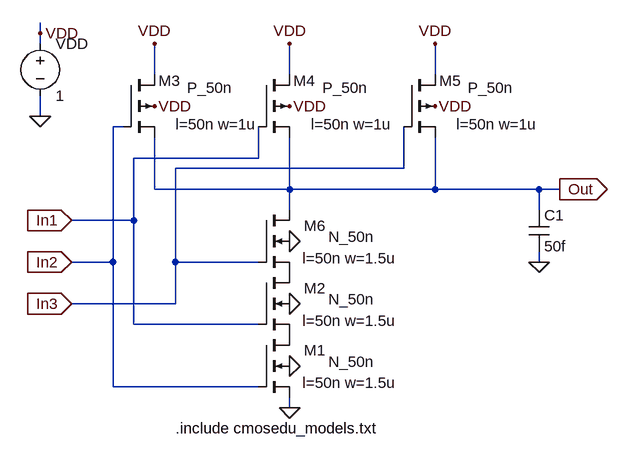
[diagram p0: schematic NAND3.asc]
NAND3.asc, the LTspice schematic file:
Version 4
SHEET 1 1208 680
WIRE 320 -512 320 -528
WIRE 320 -496 320 -512
WIRE 496 -448 496 -496
WIRE 704 -448 704 -496
WIRE 928 -448 928 -496
WIRE 320 -384 320 -416
WIRE 448 -368 432 -368
WIRE 656 -320 656 -368
WIRE 656 -320 464 -320
WIRE 880 -304 880 -368
WIRE 880 -304 528 -304
WIRE 496 -272 496 -352
WIRE 704 -272 704 -352
WIRE 704 -272 496 -272
WIRE 928 -272 928 -352
WIRE 928 -272 704 -272
WIRE 1088 -272 928 -272
WIRE 1120 -272 1088 -272
WIRE 704 -240 704 -272
WIRE 1088 -240 1088 -272
WIRE 464 -224 464 -320
WIRE 464 -224 368 -224
WIRE 432 -160 432 -368
WIRE 432 -160 368 -160
WIRE 528 -160 528 -304
WIRE 656 -160 528 -160
WIRE 1088 -160 1088 -176
WIRE 528 -96 528 -160
WIRE 528 -96 368 -96
WIRE 464 -64 464 -224
WIRE 656 -64 464 -64
WIRE 432 32 432 -160
WIRE 656 32 432 32
WIRE 704 64 704 48
FLAG 704 -96 0
FLAG 320 -384 0
FLAG 320 -512 VDD
FLAG 496 -400 VDD
FLAG 704 64 0
FLAG 496 -496 VDD
FLAG 704 -400 VDD
FLAG 704 -496 VDD
FLAG 704 0 0
FLAG 1088 -160 0
FLAG 1120 -272 Out
IOPIN 1120 -272 Out
FLAG 368 -224 In1
IOPIN 368 -224 In
FLAG 368 -160 In2
IOPIN 368 -160 In
FLAG 928 -400 VDD
FLAG 928 -496 VDD
FLAG 704 -192 0
FLAG 368 -96 In3
IOPIN 368 -96 In
SYMBOL voltage 320 -512 R0
WINDOW 123 0 0 Left 2
WINDOW 39 0 0 Left 2
SYMATTR InstName VDD
SYMATTR Value 1
SYMBOL pmos4 448 -448 R0
WINDOW 0 88 9 Right 2
WINDOW 3 168 20 Right 2
WINDOW 123 206 76 Right 2
SYMATTR InstName M3
SYMATTR Value P_50n
SYMATTR Value2 l=50n w=1u
SYMBOL nmos4 656 -48 R0
WINDOW 0 104 24 Right 2
WINDOW 3 179 41 Right 2
WINDOW 123 213 74 Right 2
SYMATTR InstName M1
SYMATTR Value N_50n
SYMATTR Value2 l=50n w=1.5u
SYMBOL nmos4 656 -144 R0
WINDOW 0 104 24 Right 2
WINDOW 3 179 41 Right 2
WINDOW 123 213 74 Right 2
SYMATTR InstName M2
SYMATTR Value N_50n
SYMATTR Value2 l=50n w=1.5u
SYMBOL pmos4 656 -448 R0
WINDOW 0 88 9 Right 2
WINDOW 3 168 20 Right 2
WINDOW 123 206 76 Right 2
SYMATTR InstName M4
SYMATTR Value P_50n
SYMATTR Value2 l=50n w=1u
SYMBOL cap 1072 -240 R0
SYMATTR InstName C1
SYMATTR Value 50f
SYMBOL pmos4 880 -448 R0
WINDOW 0 88 9 Right 2
WINDOW 3 168 20 Right 2
WINDOW 123 206 76 Right 2
SYMATTR InstName M5
SYMATTR Value P_50n
SYMATTR Value2 l=50n w=1u
SYMBOL nmos4 656 -240 R0
WINDOW 0 104 24 Right 2
WINDOW 3 179 41 Right 2
WINDOW 123 213 74 Right 2
SYMATTR InstName M6
SYMATTR Value N_50n
SYMATTR Value2 l=50n w=1.5u
TEXT 528 96 Left 2 !.include cmosedu_models.txt

The netlist it stands for:
* NAND3.asc
VDD VDD 0 1
M3 VDD In2 Out VDD P_50n l=50n w=1u
M1 P001 In2 0 0 N_50n l=50n w=1.5u
M2 P002 In1 P001 0 N_50n l=50n w=1.5u
M4 VDD In1 Out VDD P_50n l=50n w=1u
C1 Out 0 50f
M5 VDD In3 Out VDD P_50n l=50n w=1u
M6 Out In3 P002 0 N_50n l=50n w=1.5u
.model NMOS NMOS
.model PMOS PMOS
.lib standard.mos
.include cmosedu_models.txt
.backanno
.end